# Altium schematic sheet Boost_Converter.SchDoc
size A4
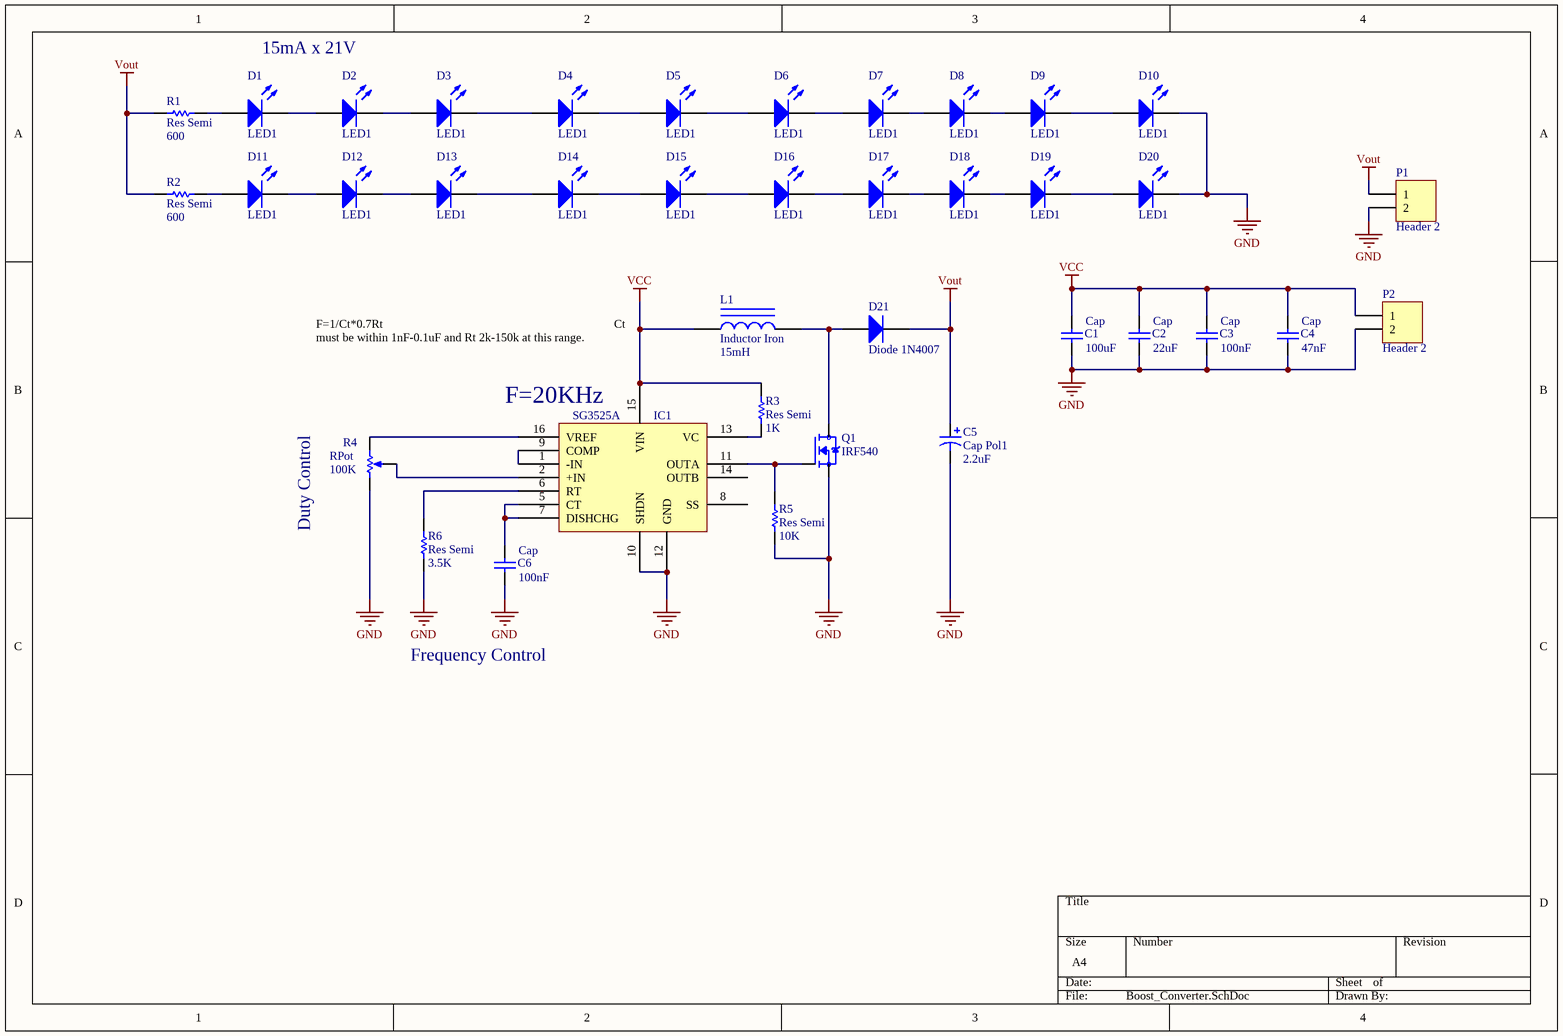
[diagram p0: Boost_Converter.SchDoc]

## Parts
C1  Cap  value 100uF  [RAD-0.3]
C2  Cap  value 22uF  [RAD-0.3]
C3  Cap  value 100nF  [RAD-0.3]
C4  Cap  value 47nF  [RAD-0.3]
C5  Cap Pol1  value 2.2uF  [RB7.6-15]
C6  Cap  value 100nF  [RAD-0.3]
D1  LED1  [LED-1]
D2  LED1  [LED-1]
D3  LED1  [LED-1]
D4  LED1  [LED-1]
D5  LED1  [LED-1]
D6  LED1  [LED-1]
D7  LED1  [LED-1]
D8  LED1  [LED-1]
D9  LED1  [LED-1]
D10  LED1  [LED-1]
D11  LED1  [LED-1]
D12  LED1  [LED-1]
D13  LED1  [LED-1]
D14  LED1  [LED-1]
D15  LED1  [LED-1]
D16  LED1  [LED-1]
D17  LED1  [LED-1]
D18  LED1  [LED-1]
D19  LED1  [LED-1]
D20  LED1  [LED-1]
D21  Diode 1N4007  [DO-41]
IC1  SG3525A  [SG3525A]
L1  Inductor Iron  value 15mH  [AXIAL-0.9]
P1  Header 2  [HDR1X2]
P2  Header 2  [HDR1X2]
Q1  IRF540  [TO254P1052X465X1989-3]
R1  Res Semi  value 600  [AXIAL-0.5]
R2  Res Semi  value 600  [AXIAL-0.5]
R3  Res Semi  value 1K  [AXIAL-0.5]
R4  RPot  value 100K  [VR5]
R5  Res Semi  value 10K  [AXIAL-0.5]
R6  Res Semi  value 3.5K  [AXIAL-0.5]

## Nets
GND: C1.1 C2.1 C3.1 C4.1 C5.2 C6.1 D10.2(K) D20.2(K) IC1.10(SHDN) IC1.12(GND) P1.2 P2.2 Q1.3(S) R4.1(TOP) R5.1 R6.1
VCC: C1.2 C2.2 C3.2 C4.2 IC1.15(VIN) L1.1 P2.1 R3.2
Vout: C5.1 D21.2(K) P1.1 R1.2 R2.2
NetC6_2: C6.2 IC1.5(CT) IC1.7(DISHCHG)
NetD1_1: D1.1(A) R1.1
NetD1_2: D1.2(K) D2.1(A)
NetD2_2: D2.2(K) D3.1(A)
NetD3_2: D3.2(K) D4.1(A)
NetD4_2: D4.2(K) D5.1(A)
NetD5_2: D5.2(K) D6.1(A)
NetD6_2: D6.2(K) D7.1(A)
NetD7_2: D7.2(K) D8.1(A)
NetD8_2: D8.2(K) D9.1(A)
NetD9_2: D9.2(K) D10.1(A)
NetD11_1: D11.1(A) R2.1
NetD11_2: D11.2(K) D12.1(A)
NetD12_2: D12.2(K) D13.1(A)
NetD13_2: D13.2(K) D14.1(A)
NetD14_2: D14.2(K) D15.1(A)
NetD15_2: D15.2(K) D16.1(A)
NetD16_2: D16.2(K) D17.1(A)
NetD17_2: D17.2(K) D18.1(A)
NetD18_2: D18.2(K) D19.1(A)
NetD19_2: D19.2(K) D20.1(A)
NetD21_1: D21.1(A) L1.2 Q1.2(D)
NetIC1_1: IC1.1(-IN) IC1.9(COMP)
NetIC1_2: IC1.2(+IN) R4.3(TAP)
NetIC1_6: IC1.6(RT) R6.2
NetIC1_11: IC1.11(OUTA) Q1.1(G) R5.2
NetIC1_13: IC1.13(VC) R3.1
NetIC1_16: IC1.16(VREF) R4.2(BOT)

Not connected (* = marked no-connect by the designer): IC1 8(SS) 14(OUTB)

## Notes on the sheet
- 15mA x 21V
- F=1/Ct*0.7Rt                                                                             Ct must be within 1nF-0.1uF and Rt 2k-150k at this range.
- (near IC1) F=20KHz
- Duty Control
- Frequency Control

## Library data of the parts
C1-C4 C6 = Cap: Capacitor; Published: 8-Jun-2000; LatestRevisionDate: 17-Jul-2002; LatestRevisionNote: Re-released for DXP Platform.; PackageReference: RAD-0.3; Publisher: Altium Limited; PackageDescription: Radial Cap, Thru-Hole; 2 Leads; 0.3 in Pin Spacing
C5 = Cap Pol1: Polarized Capacitor (Radial); Published: 8-Jun-2000; LatestRevisionDate: 17-Jul-2002; LatestRevisionNote: Re-released for DXP Platform.; PackageReference: RB7.6-15; Publisher: Altium Limited; PackageDescription: Polarized Capacitor (Radial); 2 Leads
D1-D20 = LED1: Typical RED GaAs LED; Published: 8-Jun-2000; LatestRevisionDate: 08-Jul-2005; LatestRevisionNote: Mech Layer 1 removed.; PackageReference: LED-1; Publisher: Altium Limited; PackageDescription: LED; 2 Leads
D21 = Diode 1N4007: 1 Amp General Purpose Rectifier; Published: 8-Jun-2000; LatestRevisionDate: 17-Jul-2002; LatestRevisionNote: Re-released for DXP Platform.; DatasheetVersion: 1998; PackageVersion: Aug-1999; PackageReference: DO-41; Publisher: Altium Limited; PackageDescription: Diode, Axial; Body 5.2 x 2.7 mm (LxDia. max), Lead Dia. 0.86 mm (max); Code_JEDEC: DO-204-AL; ComponentLink1Description: Manufacturer Link; ComponentLink1URL: http://www.fairchildsemi.com/; ComponentLink2Description: Datasheet; ComponentLink2URL: http://www.fairchildsemi.com/ds/1N%2F1N4001.pdf
IC1 = SG3525A: PWM GENERATOR IC
L1 = Inductor Iron: Magnetic-Core Inductor; Published: 24-Mar-1999; LatestRevisionDate: 17-Jul-2002; LatestRevisionNote: Re-released for DXP Platform.; PackageReference: AXIAL-0.9; Publisher: Altium Limited; PackageDescription: Axial Device, Thru-Hole; 2 Leads; 0.9 in Pin Spacing
P1 P2 = Header 2: Header, 2-Pin; LatestRevisionDate: 17-Jul-2002; LatestRevisionNote: Re-released for DXP Platform.; Publisher: Altium Limited
Q1 = IRF540: N-Channel 100V 22A _Tc_ 85W _Tc_ Through Hole TO-220AB; MF: Vishay; Package: TO-220-3 Samsung; Price: None; Availability: Unavailable; MP: IRF540; SnapEDA_Link: https://www.snapeda.com/parts/IRF540/Vishay%20Siliconix/view-part/1024526/?ref=snap; Value: *
R1-R3 R5 R6 = Res Semi: Semiconductor Resistor; Published: 8-Jun-2000; LatestRevisionDate: 17-Jul-2002; LatestRevisionNote: Re-released for DXP Platform.; PackageReference: AXIAL-0.5; Publisher: Altium Limited; PackageDescription: Axial Device, Thru-Hole; 2 Leads; 0.5 in Pin Spacing
R4 = RPot: Potentiometer; Sim Note: Enter the Resistance value and the set point into parameter fields.; Set Position: 0.5; Published: 8-Jun-2000; LatestRevisionDate: 17-Jul-2002; LatestRevisionNote: Re-released for DXP Platform.; PackageReference: VR5; Publisher: Altium Limited; PackageDescription: Variable Resistor, Thru-Hole; 3 Leads